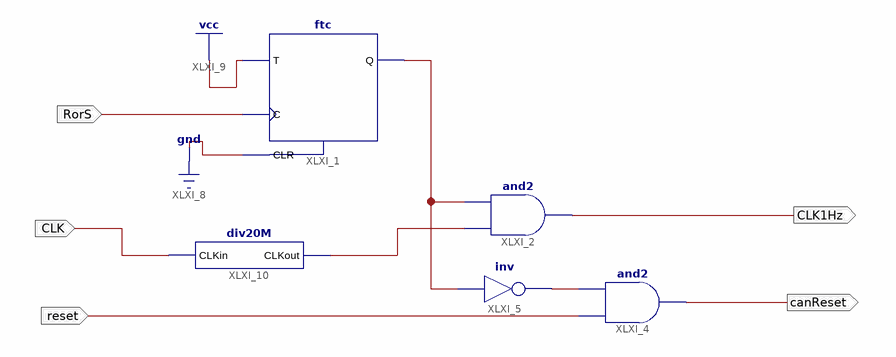
[diagram p0: schematic sheet 1]
// Xilinx ISE schematic clock.sch (spartan6) as structural Verilog: 5 symbols, 5 ports
module clock (
  input  reset,
  input  RorS,
  input  CLK,
  output CLK1Hz,
  output canReset
);

  wire XLXN_4, XLXN_6, XLXN_17;

  ftc XLXI_1 (.C(RorS), .CLR(1'b0), .T(1'b1), .Q(XLXN_4));
  and XLXI_2 (CLK1Hz, XLXN_17, XLXN_4);
  and XLXI_4 (canReset, reset, XLXN_6);
  not XLXI_5 (XLXN_6, XLXN_4);
  div20M XLXI_10 (.CLKin(CLK), .CLKout(XLXN_17));
endmodule
